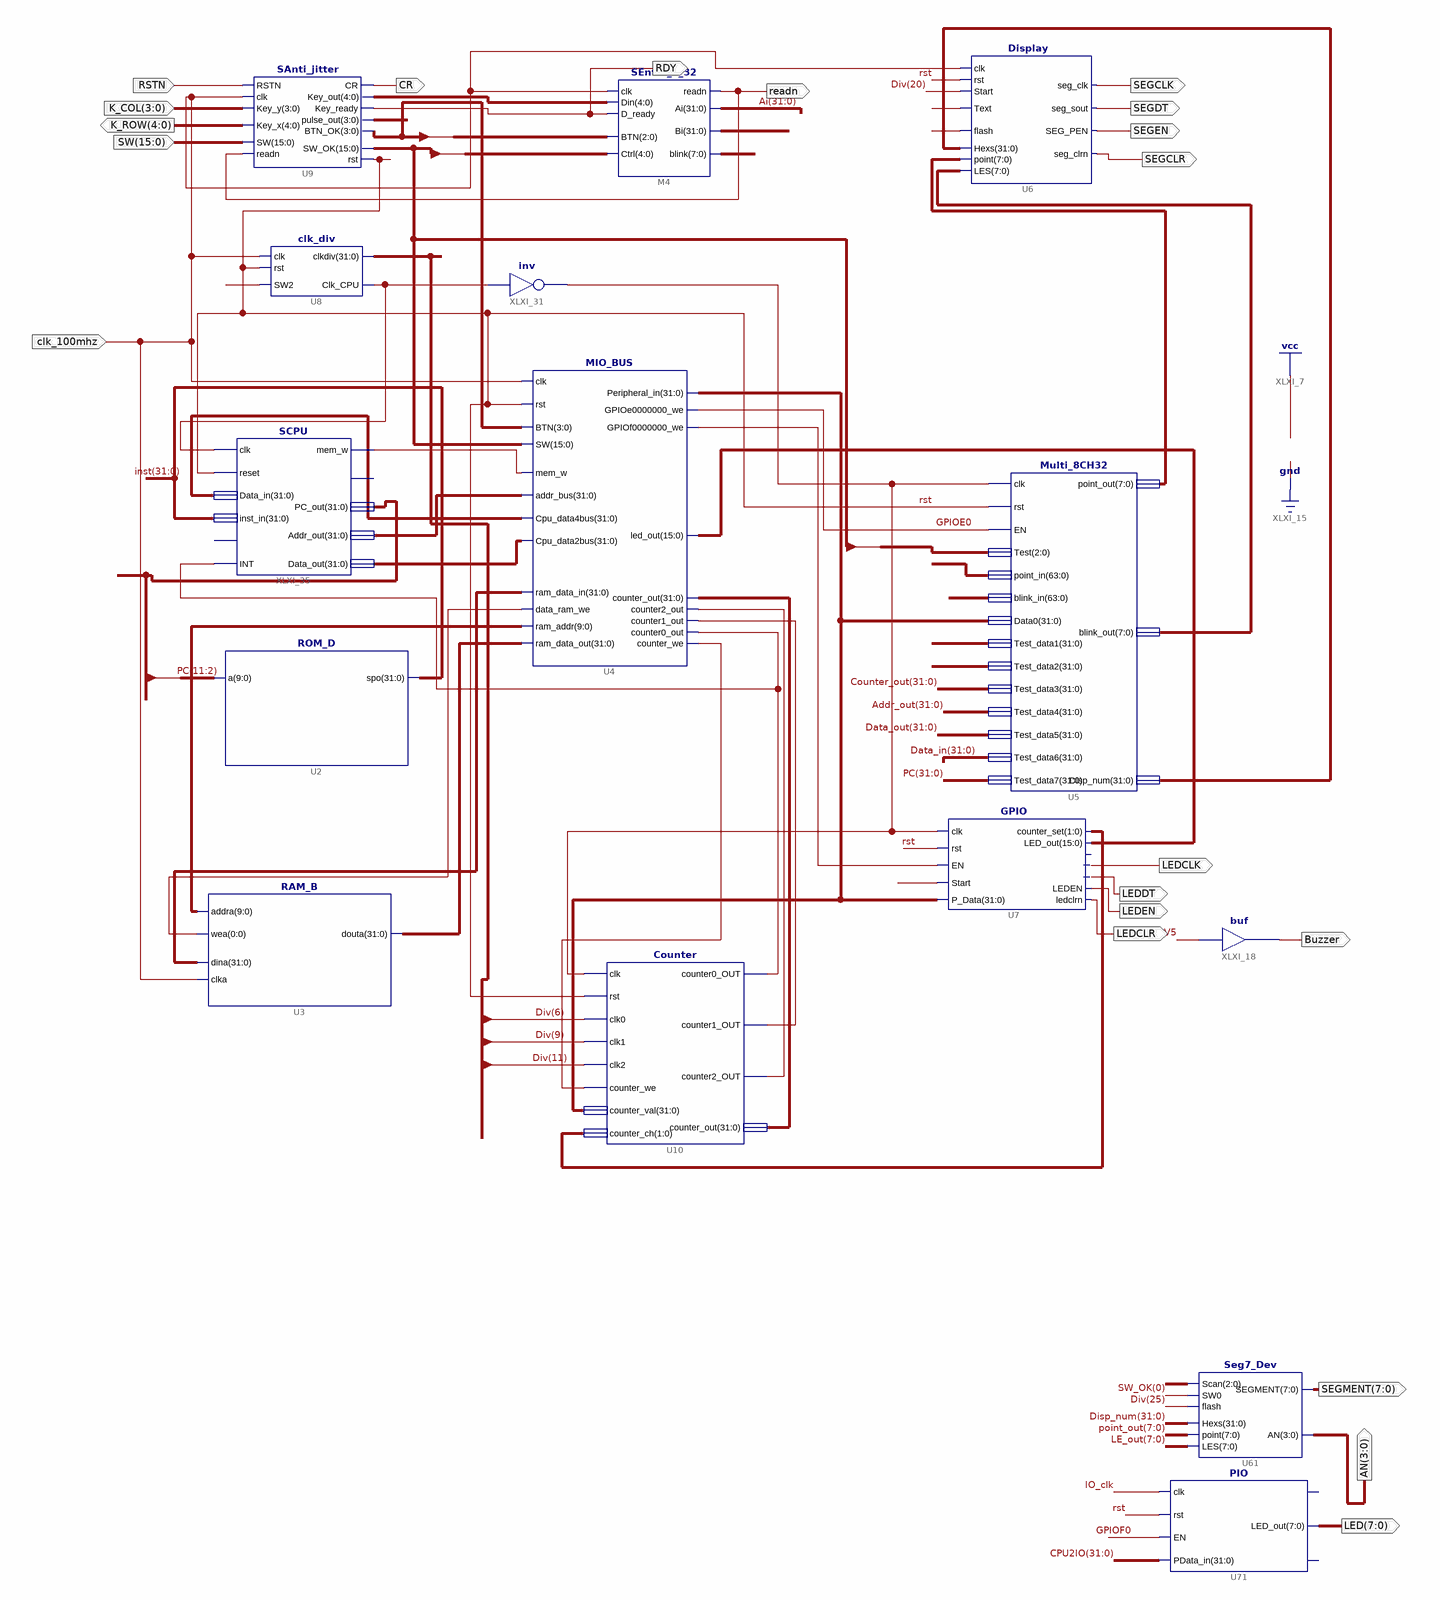
[diagram p0: schematic sheet 1]
// Xilinx ISE schematic Oexp02_IO.sch (kintex7) as structural Verilog: 15 symbols, 20 ports
module Oexp02_IO (
  input  [3:0] K_COL,
  input  [15:0] SW,
  input  RSTN,
  input  clk_100mhz,
  output CR,
  output RDY,
  output [4:0] K_ROW,
  output readn,
  output SEGCLK,
  output SEGDT,
  output SEGEN,
  output SEGCLR,
  output LEDDT,
  output LEDCLR,
  output LEDCLK,
  output LEDEN,
  output Buzzer,
  output [7:0] LED,
  output [3:0] AN,
  output [7:0] SEGMENT
);

  wire Clk_CPU, GPIOE0, GPIOF0, INT, IO_clk, mem_w, rst, XLXN_132, XLXN_133, XLXN_135;
  wire [0:0] XLXN_160;
  wire [1:0] XLXN_148;
  wire [3:0] BTN_OK, Pulse;
  wire [4:0] Key_out;
  wire [7:0] blink, LE_out, point_out;
  wire [9:0] XLXN_162;
  wire [15:0] LED_out, SW_OK;
  wire [31:0] Addr_out, Ai, Bi, Counter_out, CPU2IO, Data_in, Data_out, Disp_num, Div, inst, PC, XLXN_159,
       XLXN_163;

  Display U6 (
    .LES(LE_out), .SEG_PEN(SEGEN), .seg_sout(SEGDT), .seg_clrn(SEGCLR), .point(point_out), .Hexs(Disp_num),
    .Text(SW_OK[0]), .flash(Div[25]), .seg_clk(SEGCLK), .clk(clk_100mhz), .rst(rst), .Start(Div[20]));
  SAnti_jitter U9 (
    .SW(SW), .readn(readn), .Key_y(K_COL), .Key_x(K_ROW), .RSTN(RSTN), .clk(clk_100mhz), .Key_out(Key_out),
    .Key_ready(RDY), .CR(CR), .rst(rst), .SW_OK(SW_OK), .pulse_out(Pulse), .BTN_OK(BTN_OK));
  clk_div U8 (.rst(rst), .clk(clk_100mhz), .SW2(SW_OK[2]), .clkdiv(Div), .Clk_CPU(Clk_CPU));
  SEnter_2_32 M4 (
    .readn(readn), .Ai(Ai), .Bi(Bi), .blink(blink), .Din(Key_out), .D_ready(RDY), .clk(clk_100mhz),
    .Ctrl({SW_OK[7:5], SW_OK[15], SW_OK[0]}), .BTN(BTN_OK[2:0]));
  GPIO U7 (
    .clk(IO_clk), .P_Data(CPU2IO), .rst(rst), .EN(GPIOF0), .Start(Div[20]), .ledclk(LEDCLK),
    .LED_out(LED_out), .counter_set(XLXN_148), .ledclrn(LEDCLR), .LEDEN(LEDEN), .ledsout(LEDDT));  // open: GPIOf0
  Multi_8CH32 U5 (
    .clk(IO_clk), .rst(rst), .EN(GPIOE0), .Test(SW_OK[7:5]), .point_in({Div, Div}), .blink_in({64{1'b0}}),
    .Data0(CPU2IO), .Test_data1({2'b00, PC[31:2]}), .Test_data2(inst), .Test_data3(Counter_out),
    .Test_data4(Addr_out), .Test_data5(Data_out), .Test_data6(Data_in), .Test_data7(PC),
    .point_out(point_out), .blink_out(LE_out), .Disp_num(Disp_num));
  buf XLXI_18 (Buzzer, 1'b1);
  RAM_B U3 (.addra(XLXN_162), .clka(clk_100mhz), .wea(XLXN_160[0]), .dina(XLXN_159), .douta(XLXN_163));
  Counter U10 (
    .clk(IO_clk), .rst(rst), .clk0(Div[6]), .clk1(Div[9]), .clk2(Div[11]), .counter_we(XLXN_135),
    .counter_val(CPU2IO), .counter_ch(XLXN_148), .counter0_OUT(INT), .counter1_OUT(XLXN_133),
    .counter2_OUT(XLXN_132), .counter_out(Counter_out));
  MIO_BUS U4 (
    .rst(rst), .clk(clk_100mhz), .mem_w(mem_w), .addr_bus(Addr_out), .Cpu_data4bus(Data_in),
    .Cpu_data2bus(Data_out), .ram_data_out(XLXN_163), .ram_addr(XLXN_162), .data_ram_we(XLXN_160[0]),
    .ram_data_in(XLXN_159), .counter_out(Counter_out), .counter2_out(XLXN_132), .counter1_out(XLXN_133),
    .counter0_out(INT), .counter_we(XLXN_135), .BTN(BTN_OK), .SW(SW_OK), .led_out(LED_out),
    .Peripheral_in(CPU2IO), .GPIOe0000000_we(GPIOE0), .GPIOf0000000_we(GPIOF0));
  not XLXI_31 (IO_clk, Clk_CPU);
  ROM_D U2 (.a(PC[11:2]), .spo(inst));
  Seg7_Dev U61 (
    .LES(LE_out), .Scan({SW_OK[1], Div[19:18]}), .SEGMENT(SEGMENT), .AN(AN), .point(point_out),
    .flash(Div[25]), .SW0(SW_OK[0]), .Hexs(Disp_num));
  PIO U71 (.clk(IO_clk), .rst(rst), .EN(GPIOF0), .PData_in(CPU2IO), .LED_out(LED));  // open: GPIOf0, counter_set
  SCPU XLXI_35 (
    .clk(Clk_CPU), .reset(rst), .Data_in(Data_in), .inst_in(inst), .INT(INT), .mem_w(mem_w), .PC_out(PC),
    .Addr_out(Addr_out), .Data_out(Data_out));  // open: MIO_ready, CPU_MIO
endmodule
